# EAGLE design BrannOvergang (EAGLE 6.4)
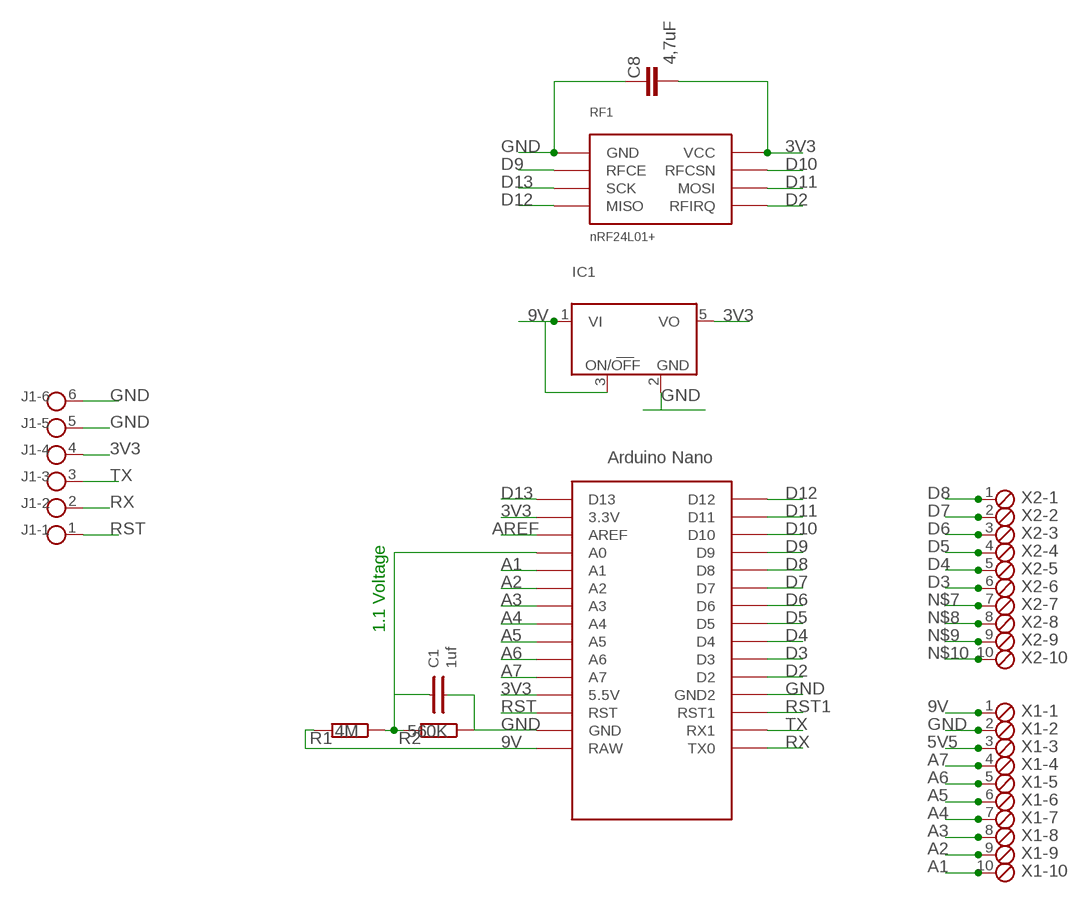
[diagram p0: schematic, sheet 1]

## Parts
C1  1uf  CC0805  [0805]
C8  4,7uF  C-EUC1206K  [C1206K]
IC1  LP2980IM5  [SOT23-5]
J1  FTDI  LIST6LIST6B  [LIST6B]
R1  4M  R-EU_R0805  [R0805]
R2  560K  R-EU_R0805  [R0805]
RF1  nRF24L01+  NRF24L01  [2X4-2.54MM]
U$1  NANO  [NANO]
X1  MPT10  [10POL254]
X2  MPT10  [10POL254]

## Nets
3V3: C8.1 IC1.5(VO) J1.4 RF1.P$2(VCC) U$1.3.3V U$1.5V(5.5V)
5V5: X1.3
9V: IC1.1(VI) IC1.3(ON/OFF) R1.2 U$1.RAW X1.1
A1: U$1.A1 X1.10
A2: U$1.A2 X1.9
A3: U$1.A3 X1.8
A4: U$1.A4 X1.7
A5: U$1.A5 X1.6
A6: U$1.A6 X1.5
A7: U$1.A7 X1.4
AREF: U$1.AREF
D2: RF1.P$8(RFIRQ) U$1.D2
D3: U$1.D3 X2.6
D4: U$1.D4 X2.5
D5: U$1.D5 X2.4
D6: U$1.D6 X2.3
D7: U$1.D7 X2.2
D8: U$1.D8 X2.1
D9: RF1.P$3(RFCE) U$1.D9
D10: RF1.P$4(RFCSN) U$1.D10
D11: RF1.P$6(MOSI) U$1.D11
D12: RF1.P$7(MISO) U$1.D12
D13: RF1.P$5(SCK) U$1.D13
GND: C1.2 C8.2 IC1.2(GND) J1.5 J1.6 R2.1 RF1.P$1(GND) U$1.GND U$1.GND1(GND2) X1.2
N$2: C1.1 R1.1 R2.2 U$1.A0
N$7: X2.7
N$8: X2.8
N$9: X2.9
N$10: X2.10
RST: J1.1 U$1.RST
RST1: U$1.RST1
RX: J1.2 U$1.TX0
TX: J1.3 U$1.RX1
Unconnected: U$1.ICSP1 U$1.ICSP2 U$1.ICSP3 U$1.ICSP4 U$1.ICSP5 U$1.ICSP6

## Notes on the sheet
- 1.1 Voltage

## Library data of the parts
C1 = rlc-smd:CC0805
C8 = rcl:C-EU: CAPACITOR, European symbol
IC1 = NATIONAL:LP2980IM5
J1 = CONNLIST:LIST6
R1 R2 = rcl:R-EU_: RESISTOR, European symbol
RF1 = matrix:NRF24L01
U$1 = AWP-Lib2:NANO: Arduino Nano
X1 X2 = con-phoenix-254:MPT10: PHOENIX CONNECTOR

## Net classes
0 default: width 0.203 mm

## Board
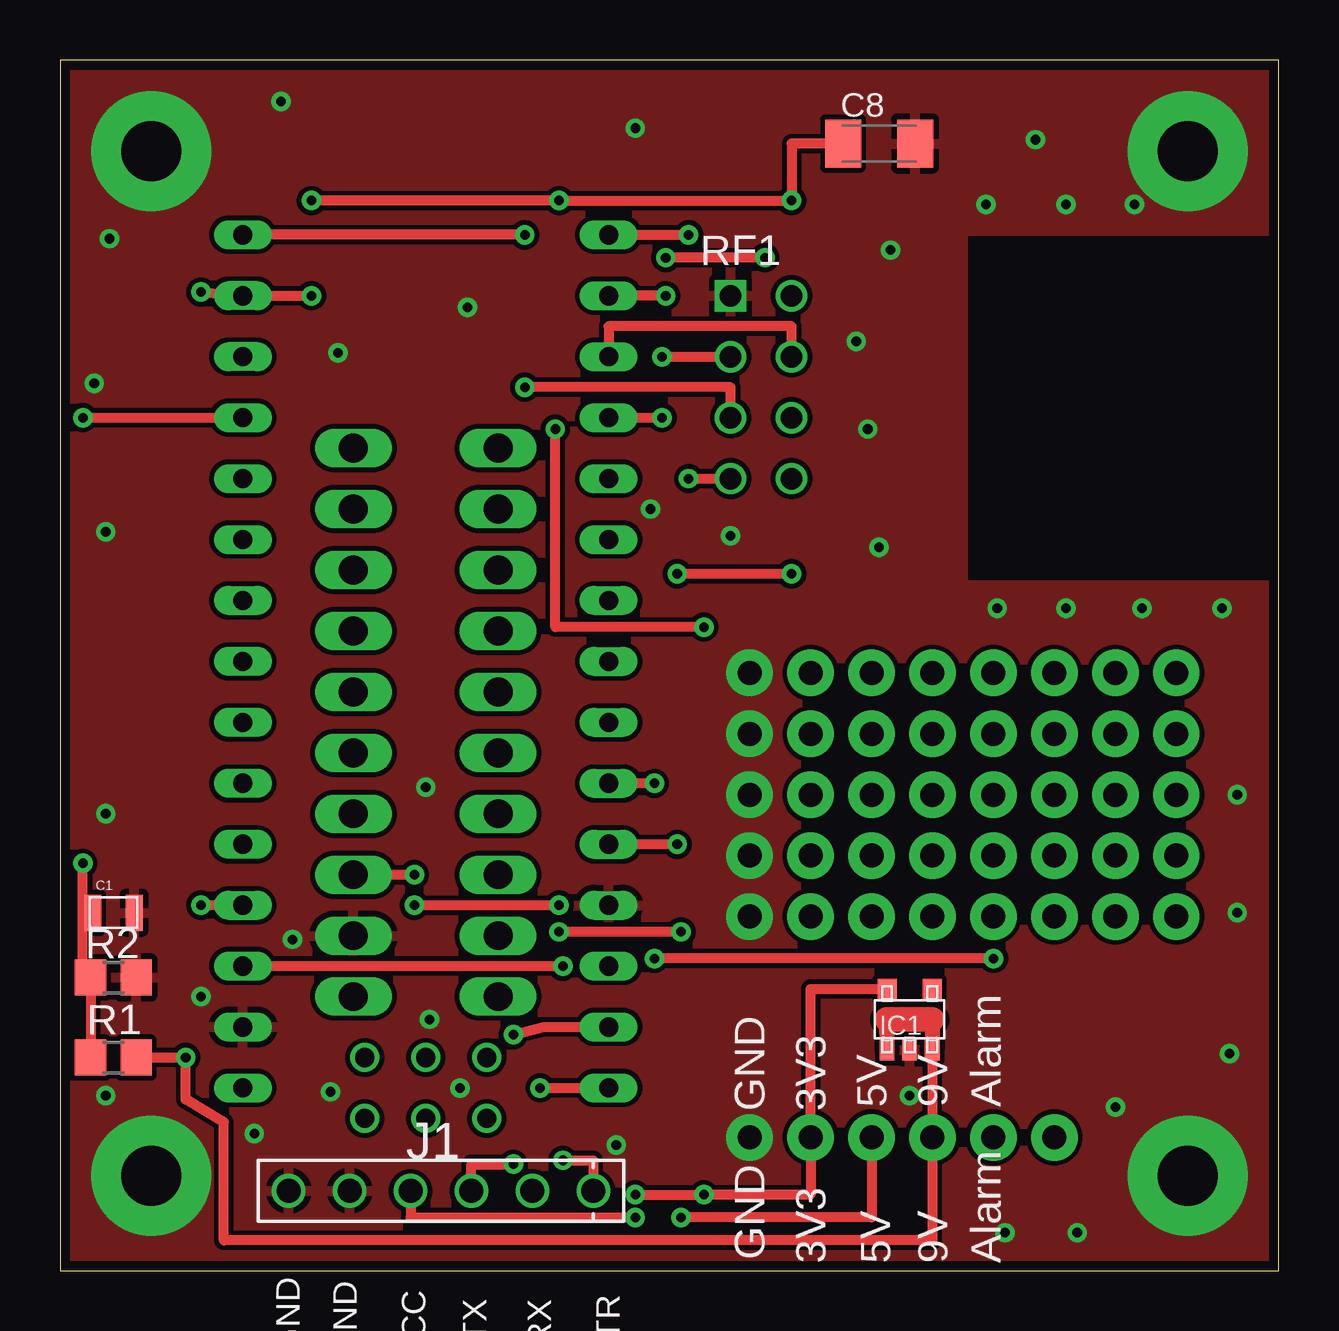
[diagram p1: board, top side]
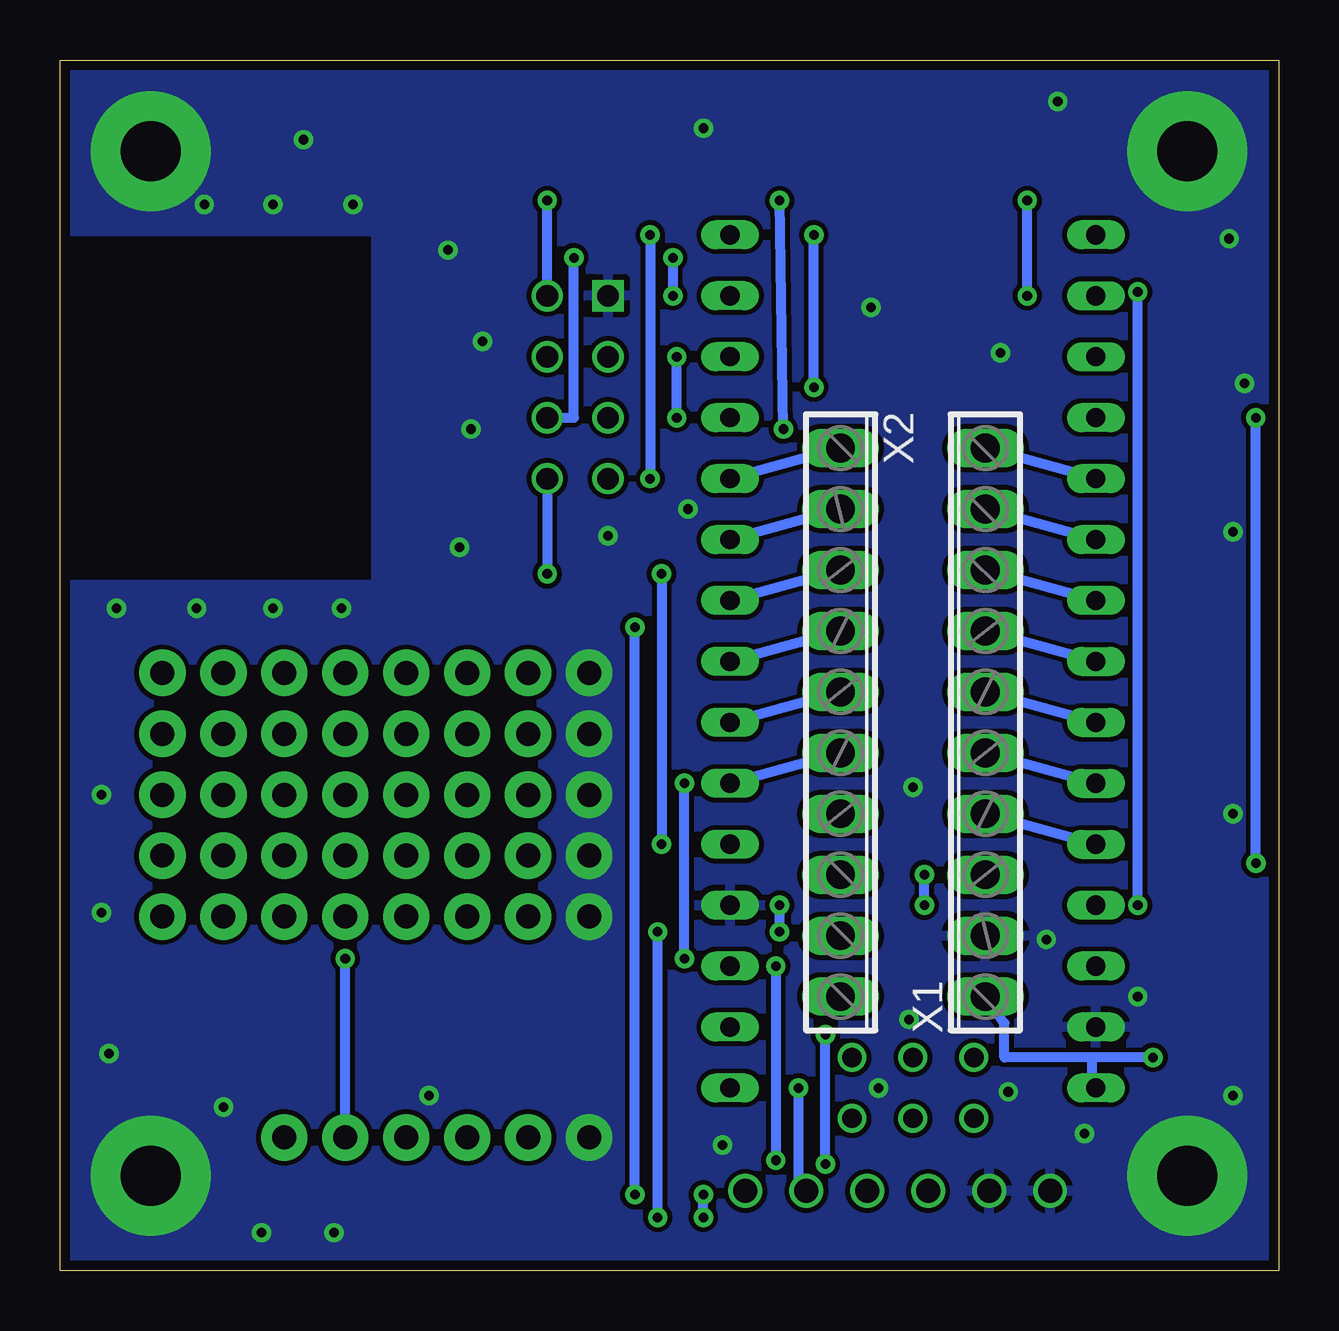
[diagram p2: board, bottom side, seen from below]

Size 50.78 x 50.47 mm. Coordinates in mm from the lower left corner, seen from the top.
Outline: 0,0 50.78,0 50.78,50.47 0,50.47 0,0
Copper layers (1*16): Top 0.035mm / dielectric 1.5mm / Bottom 0.035mm
Design rules "8mil_capinor": minimum track width 4mil, minimum drill 0.2997mm, track to track 8mil, track to pad 8mil, pad to pad 8mil, via to via 8mil, smd to smd 0mil, copper to edge 16mil, drill to drill 16mil, minimum pad ring 8mil, minimum via ring 8mil, stop-mask expansion 0mil, vias tented up to drill 16mil, thermal gap 10mil

### Footprints (pad centres in the part's own frame; a part is rotated, then mirrored left to right if it is on the bottom)
0805 = smd 0.711 x 1.499: 1 -0.864,0; 2 0.864,0
C1206K = smd 1.5 x 2: 1 -1.5,0; 2 1.5,0
SOT23-5 = smd 0.61 x 0.889: 1 -0.94,-1.27; 2 0,-1.27; 3 0.94,-1.27 | smd 0.787 x 0.889: 4 0.94,1.245; 5 -0.94,1.245
LIST6B = drill 1: 1 -6.35,0; 2 -3.81,0; 3 -1.27,0; 4 1.27,0; 5 3.81,0; 6 6.35,0
R0805 = smd 1.3 x 1.5: 1 -0.95,0; 2 0.95,0
2X4-2.54MM = drill 0.9 square: P$1 0,0 | drill 0.9: P$2 2.54,0; P$3 0,-2.54; P$4 2.54,-2.54; P$5 0,-5.08; P$6 2.54,-5.08; P$7 0,-7.62; P$8 2.54,-7.62
NANO = drill 0.8 long: 3.3V -10.16,24.13; 5V -10.16,-1.27; A0 -10.16,19.05; A1 -10.16,16.51; A2 -10.16,13.97; A3 -10.16,11.43; A4 -10.16,8.89; A5 -10.16,6.35; A6 -10.16,3.81; A7 -10.16,1.27; AREF -10.16,21.59; D2 5.08,1.27; D3 5.08,3.81; D4 5.08,6.35; D5 5.08,8.89; D6 5.08,11.43; D7 5.08,13.97; D8 5.08,16.51; D9 5.08,19.05; D10 5.08,21.59; D11 5.08,24.13; D12 5.08,26.67; D13 -10.16,26.67; GND -10.16,-6.35; GND1 5.08,-1.27; RAW -10.16,-8.89; RST -10.16,-3.81; RST1 5.08,-3.81; RX1 5.08,-6.35; TX0 5.08,-8.89 | drill 0.8: ICSP1 -5.08,-10.16; ICSP2 -5.08,-7.62; ICSP3 -2.54,-10.16; ICSP4 -2.54,-7.62; ICSP5 0,-10.16; ICSP6 0,-7.62
10POL254 = drill 1.2 long: 1 -11.43,0; 2 -8.89,0; 3 -6.35,0; 4 -3.81,0; 5 -1.27,0; 6 1.27,0; 7 3.81,0; 8 6.35,0; 9 8.89,0; 10 11.43,0

### Placement (x,y rotation side)
C1  2.22,14.92 0 top
C8  34.13,46.99 0 top
IC1  35.4,10.48 0 top
J1  15.88,3.33 180 top
R1  2.22,8.89 0 top
R2  2.22,12.22 180 top
RF1  27.94,40.64 0 top
U$1  17.78,16.51 0 top
X1  12.22,22.86 90 bottom
X2  18.26,22.86 270 bottom

### Tracks (layer width: path | path; a pad name or v marks a point on that pad's centre or on a via)
3V3  (via drill 0.4, 1 pad 1.93)
  Top 0.406: v10.48,44.61 v20.8,44.61 v30.48,44.61 30.48,46.99 C8.1 | v10.48,40.64 U$1.3.3V v5.87,40.8 | 27,3.17 31.27,3.17 v31.27,5.56 31.27,11.75 34.45,11.75 IC1.5 | 27,3.17 v26.83,3.17 | v26.83,26.83 20.64,26.83 v20.64,35.08 | U$1.5V v5.87,15.24 | J1.4 14.61,2.22 v23.97,2.22 | v23.97,3.17 27,3.17
  Bottom 0.406: RF1.P$2 v30.48,44.61 | v10.48,40.64 v10.48,44.61 | v26.83,3.17 v26.83,26.83 | v20.64,35.08 v20.8,44.61 | v5.87,15.24 v5.87,40.8 | v23.97,2.22 v23.97,3.17
5V5  (via drill 0.4, 1 pad 1.93)
  Top 0.406: v33.81,5.56 33.81,2.22 v25.88,2.22 | v25.88,14.13 v20.8,14.13 | v20.8,15.24 v14.76,15.24 | v14.76,16.51 X1.3
  Bottom 0.406: v25.88,2.22 v25.88,14.13 | v20.8,14.13 v20.8,15.24 | v14.76,15.24 v14.76,16.51
9V  (via drill 0.4, 1 pad 1.93)
  Top 0.406: R1.2 v5.24,8.89 5.24,7.14 6.83,6.19 6.83,1.27 36.35,1.27 v36.35,5.56 IC1.3
  Top 0.635: IC1.1 34.45,10.48 | 36.35,10.48 IC1.3
  Top 1.016: 34.45,10.48 36.35,10.48
  Bottom 0.406: v5.24,8.89 7.78,8.89 | 7.78,8.89 11.43,8.89 11.43,10.32 X1.1 | U$1.RAW 7.78,7.62 7.78,8.89
A1
  Bottom 0.406: U$1.A1 X1.10
A2
  Bottom 0.406: U$1.A2 X1.9
A3
  Bottom 0.406: U$1.A3 X1.8
A4
  Bottom 0.406: U$1.A4 X1.7
A5
  Bottom 0.406: U$1.A5 X1.6
A6
  Bottom 0.406: U$1.A6 X1.5
A7
  Bottom 0.406: U$1.A7 X1.4
D2  (via drill 0.4)
  Top 0.406: v30.48,29.05 v25.72,29.05 | v25.72,17.78 U$1.D2
  Bottom 0.406: RF1.P$8 v30.48,29.05 | v25.72,29.05 v25.72,17.78
D3  (via drill 0.4, 1 pad 1.93)
  Top 0.406: v38.89,13.02 v24.77,13.02 | v24.77,20.32 U$1.D3
  Bottom 0.406: X2.6 U$1.D3 | v38.89,5.56 v38.89,13.02 | v24.77,13.02 v24.77,20.32
D4
  Bottom 0.406: X2.5 U$1.D4
D5
  Bottom 0.406: X2.4 U$1.D5
D6
  Bottom 0.406: X2.3 U$1.D6
D7
  Bottom 0.406: X2.2 U$1.D7
D8
  Bottom 0.406: X2.1 U$1.D8
D9  (via drill 0.4)
  Top 0.406: U$1.D9 v25.08,35.56 | v25.08,38.1 RF1.P$3
  Bottom 0.406: v25.08,35.56 v25.08,38.1
D10
  Top 0.406: RF1.P$4 30.48,39.37 22.86,39.37 U$1.D10
D11  (via drill 0.4)
  Top 0.406: v29.37,42.23 v25.24,42.23 | v25.24,40.64 U$1.D11
  Bottom 0.406: RF1.P$6 29.37,35.56 v29.37,42.23 | v25.24,42.23 v25.24,40.64
D12  (via drill 0.4)
  Top 0.406: U$1.D12 v26.19,43.18 | v26.19,33.02 RF1.P$7 28.1,33.02
  Bottom 0.406: v26.19,43.18 v26.19,33.02
D13  (via drill 0.4)
  Top 0.406: RF1.P$5 27.94,36.83 v19.37,36.83 | v19.37,43.18 U$1.D13
  Bottom 0.406: v19.37,36.83 v19.37,43.18
GND  (via drill 0.4, 1 pad 1.93, 2.5 pad 5)
  other vias: 3.81,3.97 46.99,3.97 46.99,46.67 3.81,46.67 33.18,38.73 28.73,5.56 28.73,14.76 28.73,17.3 28.73,19.84 28.73,22.38 28.73,24.92 33.66,35.08 34.13,30.16 34.61,42.55 40.64,47.15 38.58,44.45 41.91,44.45 44.77,44.45 23.97,47.62 9.21,48.74 2.06,43.02 1.43,36.99 1.91,30.8 1.91,19.05 11.59,38.26 16.99,40.16 24.61,31.75 1.91,7.3 8.1,5.71 23.18,5.24 39.05,27.62 41.91,27.62 45.09,27.62 48.42,27.62 15.4,10.48 15.24,20.16 11.27,7.46 39.37,1.59 42.39,1.59 43.97,6.83 48.74,9.05 49.05,14.92 49.05,19.84 5.87,11.43 9.68,13.81 27.94,30.64 16.67,7.62 35.4,7.3
  pour Bottom: 0,50.48 50.8,50.48 50.8,43.34 37.62,43.34 37.62,28.58 50.8,28.58 50.8,0 0,0
  pour Top: 0,50.48 50.8,50.48 50.8,43.34 37.62,43.34 37.62,28.58 50.8,28.58 50.8,0 0,0
N$1  (via drill 1 pad 1.93)
  other vias: 33.81,24.92
N$2  (via drill 0.4)
  Top 0.406: v0.95,35.56 U$1.A0 | 0.95,14.92 C1.1 0.95,14.92 | 0.95,14.92 v0.95,16.99 | R1.1 R2.2 1.2,12.31 0.95,12.22 0.95,14.92
  Bottom 0.406: v0.95,16.99 v0.95,35.56
N$3  (via drill 1 pad 1.93)
  other vias: 36.35,22.38
N$4  (via drill 1 pad 1.93)
  other vias: 36.35,24.92
N$5  (via drill 1 pad 1.93)
  other vias: 38.89,22.38
N$6  (via drill 1 pad 1.93)
  other vias: 38.89,24.92
N$11  (via drill 1 pad 1.93)
  other vias: 43.97,22.38
N$12  (via drill 1 pad 1.93)
  other vias: 46.51,22.38
N$13  (via drill 1 pad 1.93)
  other vias: 46.51,24.92
N$15  (via drill 1 pad 1.93)
  other vias: 41.43,5.56
N$17  (via drill 1 pad 1.93)
  other vias: 36.35,17.3
N$18  (via drill 1 pad 1.93)
  other vias: 31.27,17.3
N$19  (via drill 1 pad 1.93)
  other vias: 38.89,17.3
N$20  (via drill 1 pad 1.93)
  other vias: 38.89,19.84
N$21  (via drill 1 pad 1.93)
  other vias: 43.97,17.3
N$22  (via drill 1 pad 1.93)
  other vias: 46.51,17.3
N$23  (via drill 1 pad 1.93)
  other vias: 46.51,19.84
N$28  (via drill 1 pad 1.93)
  other vias: 36.35,14.76
N$30  (via drill 1 pad 1.93)
  other vias: 38.89,14.76
N$33  (via drill 1 pad 1.93)
  other vias: 46.51,14.76
N$49  (via drill 1 pad 1.93)
  other vias: 33.81,22.38
N$50  (via drill 1 pad 1.93)
  other vias: 31.27,24.92
N$51  (via drill 1 pad 1.93)
  other vias: 41.43,24.92
N$52  (via drill 1 pad 1.93)
  other vias: 43.97,24.92
N$53  (via drill 1 pad 1.93)
  other vias: 41.43,22.38
N$54  (via drill 1 pad 1.93)
  other vias: 41.43,19.84
N$55  (via drill 1 pad 1.93)
  other vias: 43.97,19.84
N$56  (via drill 1 pad 1.93)
  other vias: 41.43,17.3
N$57  (via drill 1 pad 1.93)
  other vias: 36.35,19.84
N$58  (via drill 1 pad 1.93)
  other vias: 33.81,19.84
N$59  (via drill 1 pad 1.93)
  other vias: 33.81,17.3
N$60  (via drill 1 pad 1.93)
  other vias: 31.27,19.84
N$63  (via drill 1 pad 1.93)
  other vias: 31.27,14.76
N$66  (via drill 1 pad 1.93)
  other vias: 33.81,14.76
N$67  (via drill 1 pad 1.93)
  other vias: 41.43,14.76
N$68  (via drill 1 pad 1.93)
  other vias: 43.97,14.76
N$81  (via drill 1 pad 1.93)
  other vias: 31.27,22.38
RST  (via drill 0.4)
  Top 0.406: U$1.RST v20.95,12.7 | v20.95,4.6 22.23,4.6 J1.1
  Bottom 0.406: v20.95,12.7 v20.95,4.6
RX  (via drill 0.4)
  Top 0.406: v20,7.62 U$1.TX0
  Bottom 0.406: J1.2 20,3.65 v20,7.62
TX  (via drill 0.4)
  Top 0.406: J1.3 17.14,4.45 v18.89,4.45 | v18.89,9.84 20.16,10.16 U$1.RX1
  Bottom 0.406: v18.89,4.45 v18.89,9.84

### Text on the board
_tsilk: GND | 3V3 | 5V | 9V | Alarm | GND | 3V3 | 5V | 9V | Alarm | TX | GND | GND | VCC | RX | DTR